# Altium schematic sheet POWER.SchDoc
size A4; SheetNumber: 6; SheetTotal: 6
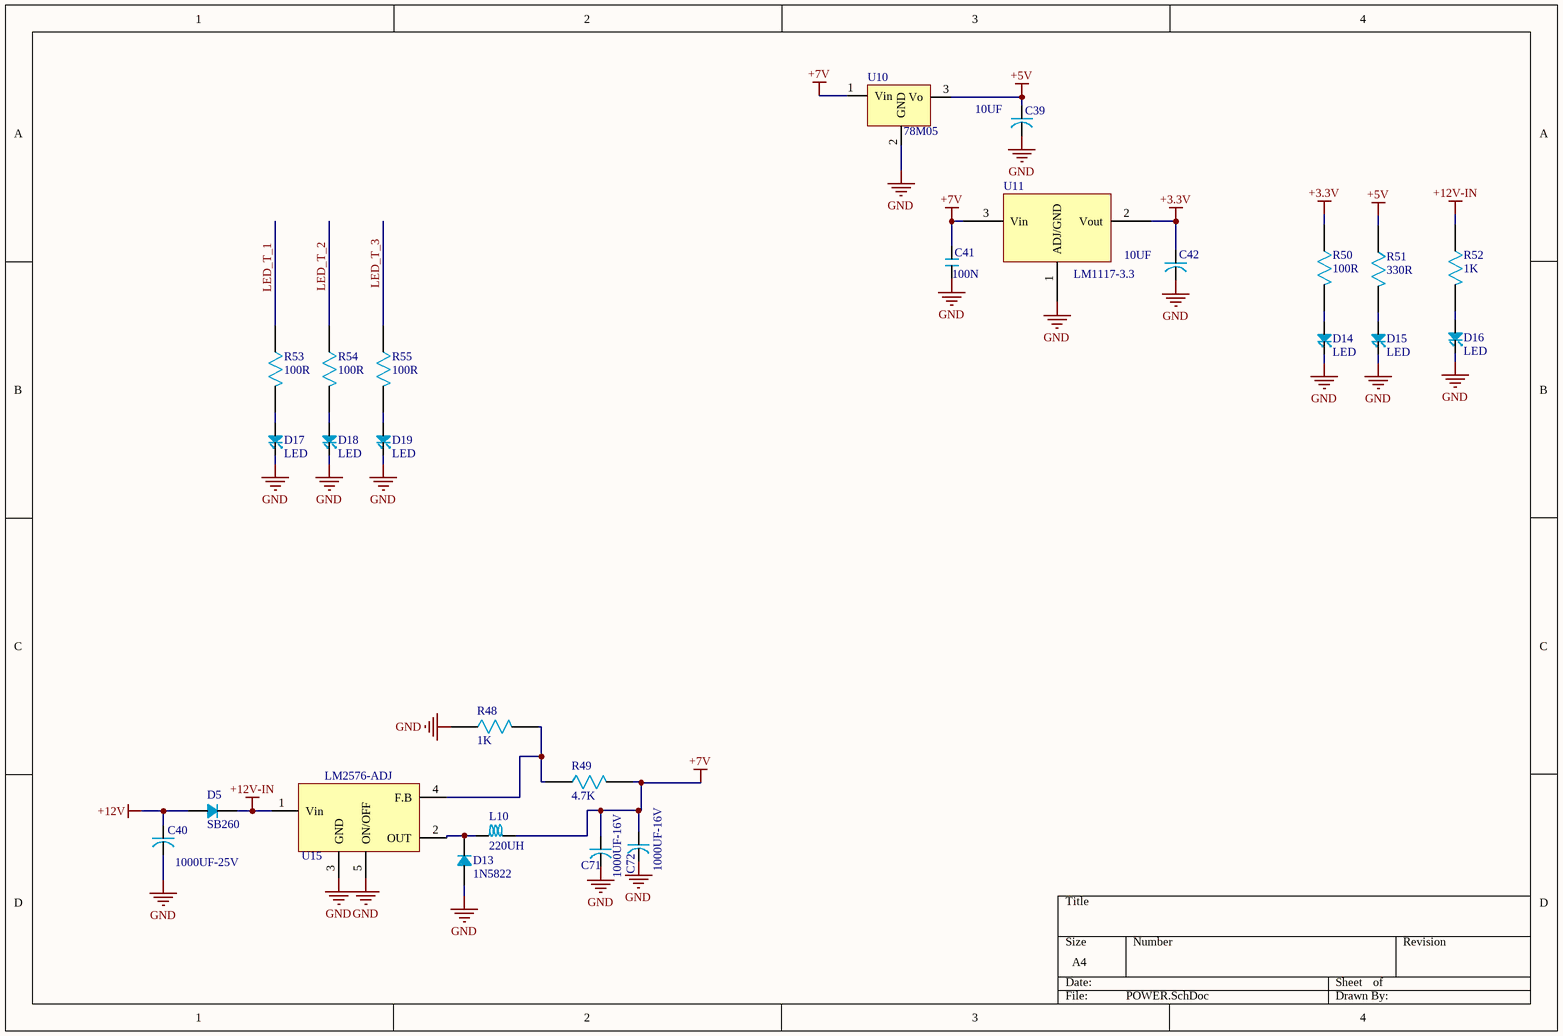
[diagram p0: POWER.SchDoc]

## Parts
C39  10UF  [1206]
C40  1000UF-25V  [RB.2/.4]
C41  100N  [1206]
C42  10UF  [1206]
C71  1000UF-16V  [RB.2/.4]
C72  1000UF-16V  [RB.2/.4]
D5  SB260  [DIODE0.1]
D13  1N5822  [SOD-123-B]
D14  LED  [0603]
D15  LED  [0603]
D16  LED  [0603]
D17  LED  [0603]
D18  LED  [0603]
D19  LED  [0603]
L10  220UH  [SELF_SMD_CD75]
R48  1K  [1206]
R49  4.7K  [1206]
R50  100R  [0603]
R51  330R  [0603]
R52  1K  [0603]
R53  100R  [0603]
R54  100R  [0603]
R55  100R  [0603]
U10  78M05  [DPAK]
U11  LM1117-3.3  [TO-252]
U15  LM2576-ADJ  [CASE936A]

## Nets
+3.3V: C42.1 R50.1 U11.2(Vout)
+5V: C39.1 R51.1 U10.3(Vo)
+7V: C41.2 C71.1 C72.1 L10.2 R49.2 U10.1(Vin) U11.3(Vin)
+12V: C40.1 D5.1
+12V-IN: D5.2 R52.1 U15.1(Vin)
GND: C39.2 C40.2 C41.1 C42.2 C71.2 C72.2 D13.1 D14.2 D15.2 D16.2 D17.2 D18.2 D19.2 R48.1 U10.2(GND) U11.1(ADJ/GND) U15.3(GND) U15.5(ON/OFF)
LED_T_1: R53.1
LED_T_2: R54.1
LED_T_3: R55.1
NetD13_2: D13.2 L10.1 U15.2(OUT)
NetD14_1: D14.1 R50.2
NetD15_1: D15.1 R51.2
NetD16_1: D16.1 R52.2
NetD17_1: D17.1 R53.2
NetD18_1: D18.1 R54.2
NetD19_1: D19.1 R55.2
NetR48_2: R48.2 R49.1 U15.4(F.B)

## Library data of the parts
C39 C40 C42 C71 C72 = CAP_POL
C41 = CAP
D5 D13 = DIODE
L10 = SELF
R48-R55 = RES
U10 = REG
U11 = LM1117
U15 = LM2576